# Altium schematic sheet Connectors.SchDoc: fNIRS - Connectors
size A3; CompanyName: UofT Capstone Team 2024991; Revision: 1; SheetNumber: 12; SheetTotal: 13
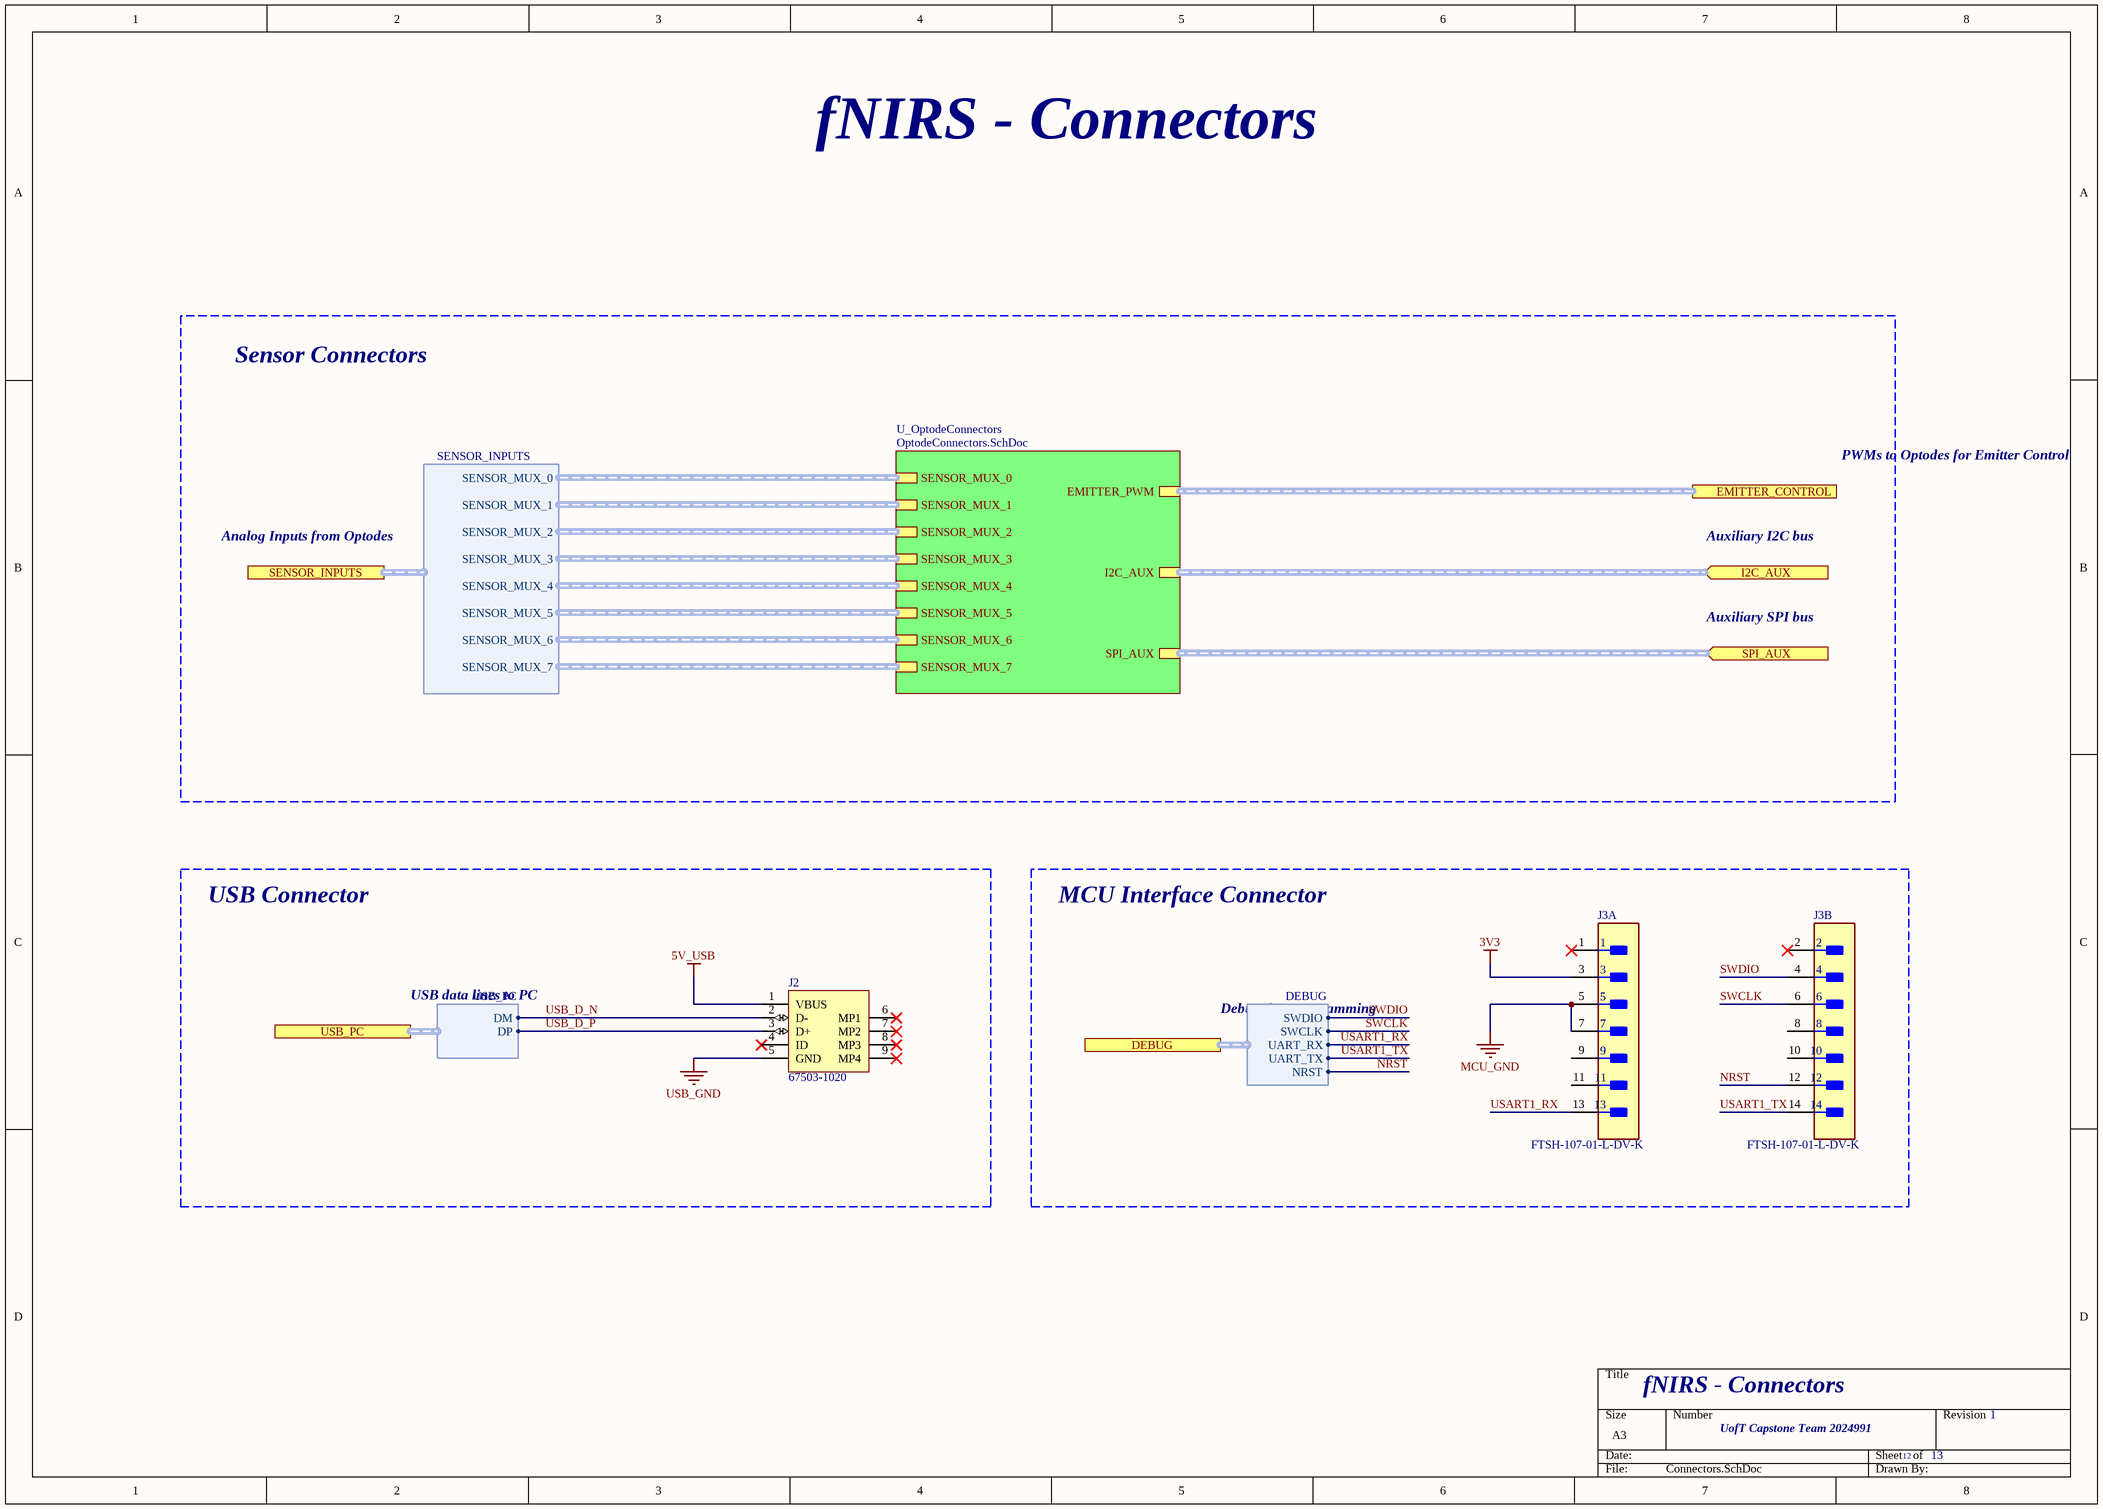
[diagram p0: Connectors.SchDoc]

## Parts
J2  67503-1020  [MOLX-67503-1020_V]
J3  FTSH-107-01-L-DV-K  [FP-FTSH-107-01-L-DV-K-MFG]  (parts A,B of 2)

## Blocks framed on the sheet
USB Connector: J2
MCU Interface Connector: J3

## Sub-sheets
U_OptodeConnectors = OptodeConnectors.SchDoc: EMITTER_PWM (harness EMITTER_PWM), SENSOR_MUX_1 (harness SENSOR_MUX_1), SENSOR_MUX_2 (harness SENSOR_MUX_2), SENSOR_MUX_3 (harness SENSOR_MUX_3), SENSOR_MUX_4 (harness SENSOR_MUX_4), SENSOR_MUX_5 (harness SENSOR_MUX_5), SENSOR_MUX_6 (harness SENSOR_MUX_6), SENSOR_MUX_7 (harness SENSOR_MUX_7), SENSOR_MUX_0 (harness SENSOR_MUX_0), SPI_AUX (harness SENSOR_MUX_7), I2C_AUX (harness SENSOR_MUX_7)

## Ports
DEBUG (harness DEBUG, see Top[3C], MCU[8C]), EMITTER_CONTROL (harness EMITTER_CONTROL, see Top[3B], OptodeControl[4B]), I2C_AUX (in, harness I2C_AUX, see Top[3C], MCU[1B], OptodeConnectors[2B]), SENSOR_INPUTS (harness SENSOR_INPUTS, see Top[3B], Sensing[1A]), SPI_AUX (in, harness SPI_AUX, see Top[3C], MCU[8D], OptodeConnectors[2A]), USB_PC (harness USB_PC, see Top[3C], MCU[1B], USBInterface[1C])

## Harnesses
USB_PC: DM, DP
SENSOR_INPUTS: SENSOR_MUX_0, SENSOR_MUX_1, SENSOR_MUX_2, SENSOR_MUX_3, SENSOR_MUX_4, SENSOR_MUX_5, SENSOR_MUX_6, SENSOR_MUX_7
DEBUG: SWDIO, SWCLK, UART_RX, UART_TX, NRST

## Nets
3V3: J3.3
5V_USB: J2.1(VBUS)
MCU_GND: J3.5 J3.7
USB_GND: J2.5(GND)
NRST: J3.12 ; port DEBUG.NRST
SWCLK: J3.6 ; port DEBUG.SWCLK
SWDIO: J3.4 ; port DEBUG.SWDIO
USART1_RX: J3.13 ; port DEBUG.UART_RX
USART1_TX: J3.14 ; port DEBUG.UART_TX
USB_D_N: J2.2(D-) ; port USB_PC.DM
USB_D_P: J2.3(D+) ; port USB_PC.DP

Not connected (* = marked no-connect by the designer): J2 4(ID)* 6(MP1)* 7(MP2)* 8(MP3)* 9(MP4)*; J3 1* 2* 8 9 10 11

## Buses and harness runs
harness port EMITTER_CONTROL = sheet U_OptodeConnectors/EMITTER_PWM
harness port I2C_AUX = sheet U_OptodeConnectors/I2C_AUX
harness port SPI_AUX = sheet U_OptodeConnectors/SPI_AUX

## Notes on the sheet
- fNIRS - Connectors
- Sensor Connectors
- PWMs to Optodes for Emitter Control
- Analog Inputs from Optodes
- Auxiliary I2C bus
- Auxiliary SPI bus
- USB data lines to PC
- Debugging/Programming

## Library data of the parts
J2 = CMP-0411-00002-1: USB, MINI, SMD, RA KME04-USBMU03A01; Manufacturer: Molex; ComponentLink1URL: http://www.molex.com/; PartNumber: 67503-1020; Mounting Technology: Surface Mount; ComponentLink1Description: Manufacturer URL; Terminal Pitch: 0.8 mm; DatasheetVersion: Rev F, 06/2009; ComponentLink2Description: Datasheet; PackageDescription: Mini USB Connector, SMT, Righer Angle; ComponentLink2URL: http://www.molex.com/pdm_docs/sd/675031020_sd.pdf; PackageReference: 67503-1020
J3 = CMP-02766-001412-1: CONN HEADER SMD 14POS 1.27MM; Number of Contacts: 14; Gender: Male; Termination: Solder; Lead Free: Lead Free; Depth: 5.84mm; Min Operating Temperature: -55°C; Length: 8.89mm; RoHS Compliant: Yes; Housing Material: Polymer; Housing Color: Black; Max Operating Temperature: 125°C; Number of Rows: 2; Pitch: 1.27mm; Radiation Hardening: No; Orientation: Straight; Packaging: Rail/Tube; Contact Material: Bronze; Contact Plating: Gold